# Altium project PythonCamera.PrjPcb
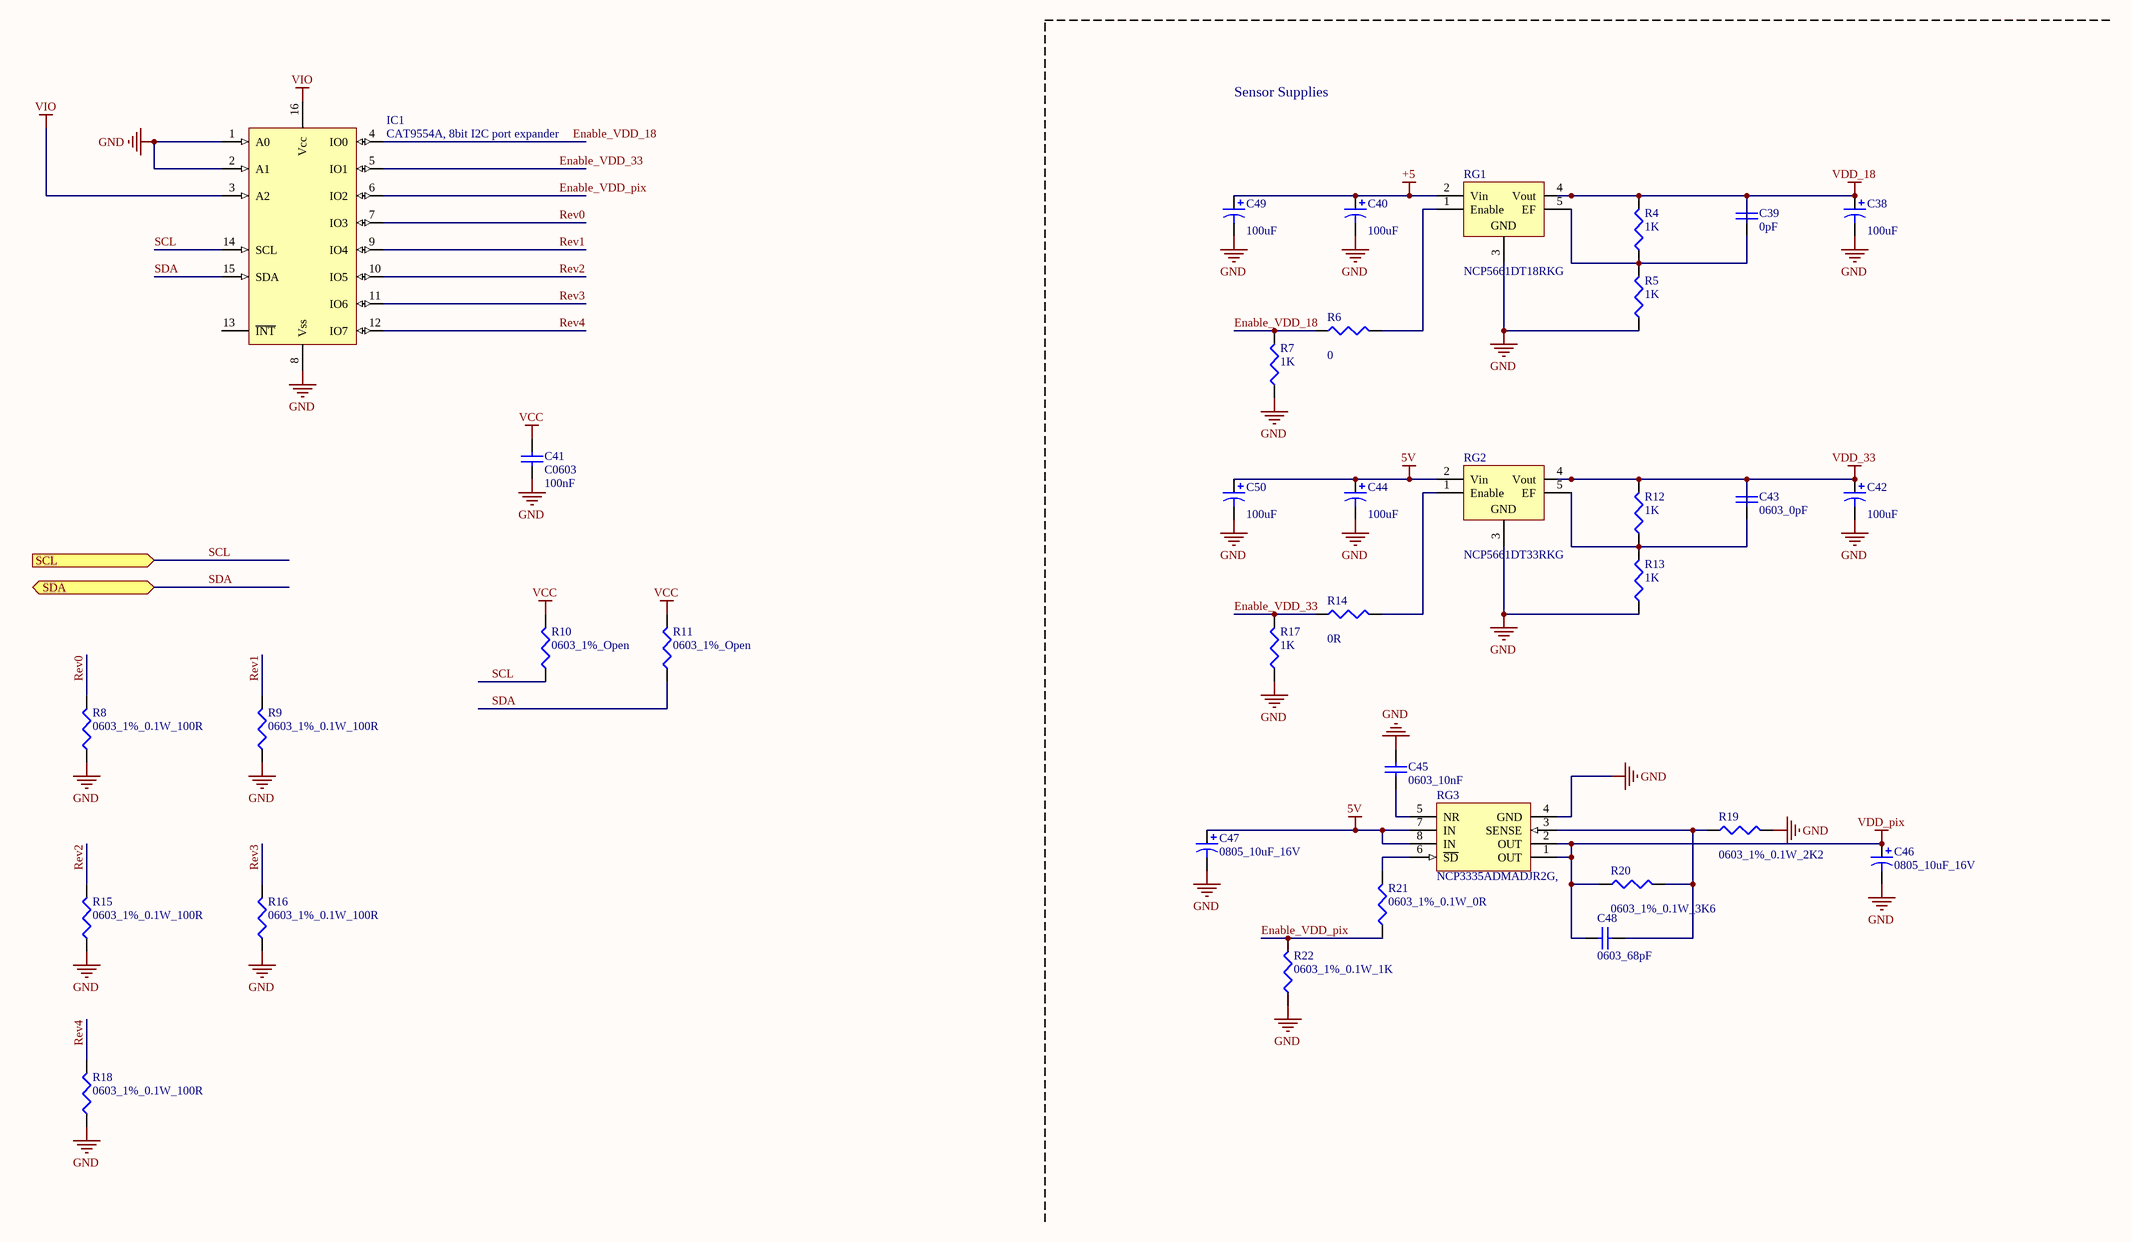
[diagram p0: powerSupply.SchDoc]
2 sheets, 48 parts. Net scope: flat (ports and power ports of the same name join across sheets).
Board file: PythonCamera.PcbDoc
Sheets:
  powerSupply.SchDoc
  imagesensor.SchDoc

## Sheet powerSupply.SchDoc
size C

### Parts
C38  value 100uF  [CC3225-1210]  (hidden comment: T494B)
C39  value 0pF  [0603]  (hidden comment: C0603)
C40  value 100uF  [CC3225-1210]  (hidden comment: T494B)
C41  C0603  value 100nF  [0603]
C42  value 100uF  [CC3225-1210]  (hidden comment: T494B)
C43  value 0603_0pF  [0603]  (hidden comment: C0603)
C44  value 100uF  [CC3225-1210]  (hidden comment: T494B)
C45  value 0603_10nF  [0603]  (hidden comment: C0603)
C46  value 0805_10uF_16V  [C0805]  (hidden comment: Cap Pol3)
C47  value 0805_10uF_16V  [C0805]  (hidden comment: Cap Pol3)
C48  value 0603_68pF  [0603]  (hidden comment: C0603)
C49  value 100uF  [CC3225-1210]  (hidden comment: T494B)
C50  value 100uF  [CC3225-1210]  (hidden comment: T494B)
IC1  CAT9554A, 8bit I2C port expander  [TSSOP16_N]
R4  value 1K  [J1-0603]  (hidden comment: Res3)
R5  value 1K  [J1-0603]  (hidden comment: Res3)
R6  value 0  [J1-0603]  (hidden comment: Res3)
R7  value 1K  [J1-0603]  (hidden comment: Res3)
R8  value 0603_1%_0.1W_100R  [J1-0603]  (hidden comment: Res3)
R9  value 0603_1%_0.1W_100R  [J1-0603]  (hidden comment: Res3)
R10  value 0603_1%_Open  [J1-0603]  (hidden comment: Res3)
R11  value 0603_1%_Open  [J1-0603]  (hidden comment: Res3)
R12  value 1K  [J1-0603]  (hidden comment: Res3)
R13  value 1K  [J1-0603]  (hidden comment: Res3)
R14  value 0R  [J1-0603]  (hidden comment: Res3)
R15  value 0603_1%_0.1W_100R  [J1-0603]  (hidden comment: Res3)
R16  value 0603_1%_0.1W_100R  [J1-0603]  (hidden comment: Res3)
R17  value 1K  [J1-0603]  (hidden comment: Res3)
R18  value 0603_1%_0.1W_100R  [J1-0603]  (hidden comment: Res3)
R19  value 0603_1%_0.1W_2K2  [J1-0603]  (hidden comment: Res3)
R20  value 0603_1%_0.1W_3K6  [J1-0603]  (hidden comment: Res3)
R21  value 0603_1%_0.1W_0R  [J1-0603]  (hidden comment: Res3)
R22  value 0603_1%_0.1W_1K  [J1-0603]  (hidden comment: Res3)
RG1  NCP5661DT18RKG  [D-PAK SIP-G5/Z10.9]
RG2  NCP5661DT33RKG  [D-PAK SIP-G5/Z10.9]
RG3  NCP3335ADMADJR2G,  [ONSC-MICRO-8-846A-02_H_V]

### Ports
SCL (in), SDA (bidir)

### Nets
5V: C44.1 C47.1 C50.1 RG2.2(Vin) RG3.7(IN) RG3.8(IN)
+5: C40.1 C49.1 RG1.2(Vin)
GND: C38.2 C40.2 C41.1 C42.2 C44.2 C45.2 C46.2 C47.2 C49.2 C50.2 IC1.1(A0) IC1.2(A1) IC1.8(Vss) R5.1 R7.1 R8.1 R9.1 R13.1 R15.1 R16.1 R17.1 R18.1 R19.2 R22.1 RG1.3(GND) RG2.3(GND) RG3.4(GND)
VCC: C41.2 R10.2 R11.2
VDD_18: C38.1 C39.2 R4.2 RG1.4(Vout)
VDD_33: C42.1 C43.2 R12.2 RG2.4(Vout)
VDD_pix: C46.1 C48.1 R20.1 RG3.1(OUT) RG3.2(OUT)
VIO: IC1.3(A2) IC1.16(Vcc)
Enable_VDD_18: IC1.4(IO0) R6.1 R7.2
Enable_VDD_33: IC1.5(IO1) R14.1 R17.2
Enable_VDD_pix: IC1.6(IO2) R21.1 R22.2
Rev0: IC1.7(IO3) R8.2
Rev1: IC1.9(IO4) R9.2
Rev2: IC1.10(IO5) R15.2
Rev3: IC1.11(IO6) R16.2
Rev4: IC1.12(IO7) R18.2
SCL: IC1.14(SCL) R10.1 ; port SCL
SDA: IC1.15(SDA) R11.1 ; port SDA
NetC39_1: C39.1 R4.1 R5.2 RG1.5(EF)
NetC43_1: C43.1 R12.1 R13.2 RG2.5(EF)
NetC45_1: C45.1 RG3.5(NR)
NetC48_2: C48.2 R19.1 R20.2 RG3.3(SENSE)
NetR6_2: R6.2 RG1.1(Enable)
NetR14_2: R14.2 RG2.1(Enable)
NetR21_2: R21.2 RG3.6(~{SD})

Not connected (* = marked no-connect by the designer): IC1 13(~{INT})

### Notes on the sheet
- Sensor Supplies

### Library data of the parts
C38 C40 C42 C44 C49 C50 = T494B: Solid Tantalum Chip Capacitor, Standard T494 Series - Low ESR, Industrial Grade; Published: 17-Jul-2002; LatestRevisionDate: 19-Mar-2004; LatestRevisionNote: Silkscreen dimensions re-sized.; DatasheetDocument: Mar-2001; PackageDocument: Mar-2001; PackageReference: B; Publisher: Altium Limited; Code_JEITA: 3528-21; ComponentLink1Description: Manufacturer Link; ComponentLink1URL: http://www.kemet.com/; ComponentLink2Description: Datasheet; ComponentLink2URL: http://www.kemet.com/kemet/web/homepage/kechome.nsf/vapubfilesname/F3102TA.pdf/$file/F3102TA.pdf
C39 C41 C43 C45 C48 = C0603: Ceramic Chip Capacitor - Standard; Note: Footprint corresponds to dimensions for bulk cassette packaging. This case size has tightened tolerances.; Published: 17-Jul-2002; LatestRevisionDate: 19-Mar-2004; LatestRevisionNote: Silkscreen size reduced.; DatasheetDocument: Mar-2001; PackageDocument: Mar-2001; PackageReference: 0603; Publisher: Altium Limited; Code_JEITA: 0603; Code_IPC: 1608 [0603]; ComponentLink1Description: Manufacturer Link; ComponentLink1URL: http://www.kemet.com/; ComponentLink2Description: Datasheet; ComponentLink2URL: http://www.kemet.com/kemet/web/homepage/kechome.nsf/vapubfilesname/F3102TA.pdf/$file/F3102TA.pdf
C46 C47 = Cap Pol3: Polarized Capacitor (Surface Mount); Published: 8-Jun-2000; LatestRevisionDate: 29-May-2009; LatestRevisionNote: IPC-7351 Footprint Added.; PackageReference: C0805; Publisher: Altium Limited; PackageDescription: Chip Capacitor
IC1 = CAT9554A: 8bit I2C port expander; Published: 16-Jan-2001; LatestRevisionDate: 13-Apr-2006; LatestRevisionNote: IPC-7351 Footprint Added.; DatasheetVersion: 1996; PackageReference: WSO16; Publisher: Altium Limited; PackageDescription: 16-Pin Small Outline Integrated Circuit 1.27 mm Pitch; Code_JEDEC: MS-013-AA; Code_IPC: SOIC127P1030-16; ComponentLink1Description: Manufacturer Link; ComponentLink1URL: http://www.maxim-ic.com/; ComponentLink2Description: Datasheet; ComponentLink2URL: http://pdfserv.maxim-ic.com/en/ds/DG300A-DG303A.pdf
R4-R22 = Res3: Resistor; Published: 8-Jun-2000; LatestRevisionDate: 29-May-2009; LatestRevisionNote: IPC-7351 Footprint Added.; PackageReference: J1-0603; Publisher: Altium Limited; PackageDescription: Chip Resistor
RG1 RG2 = NCP5661: Low Dropout Voltage Regulator; Note: Heatsink surface is connected to Pin 3; Published: 15-Apr-2002; DatasheetVersion: 1997; PackageVersion: 1997; PackageReference: 314A-03; Publisher: Altium Limited; PackageDescription: TO, Thru-Hole, Horizontal, Heatsink Mounted; 5 Bent Staggered Leads; Pitch 1.7 mm; ComponentLink1Description: Manufacturer Link; ComponentLink1URL: http://www.onsemi.com/site/products/taxonomy/0,4438,503,00.html; ComponentLink2Description: Datasheet; ComponentLink2URL: http://www.onsemi.com/pub/Collateral/LM2931-D.PDF
RG3 = NCP3335: NCP3335ADMADJR2G, ADJ Ultra High Accuracy, Low Iq, 500 mA Low Dropout Regulator; Published: 15-Apr-2002; LatestRevisionDate: 13-Apr-2006; LatestRevisionNote: IPC-7351 Footprint Added.; DatasheetVersion: 1998; PackageVersion: 1998; PackageReference: 751-05; Publisher: Altium Limited; PackageDescription: 8-Pin Small Outline Integrated Circuit 1.27 mm Pitch; Code_JEDEC: MS-012-AA; Code_IPC: SOIC127P600-8; ComponentLink1Description: Manufacturer Link; ComponentLink1URL: http://www.onsemi.com/site/products/taxonomy/0,4438,503,00.html; ComponentLink2Description: Datasheet; ComponentLink2URL: http://www.onsemi.com/pub/Collateral/MC33264-D.PDF

## Sheet imagesensor.SchDoc
size A3
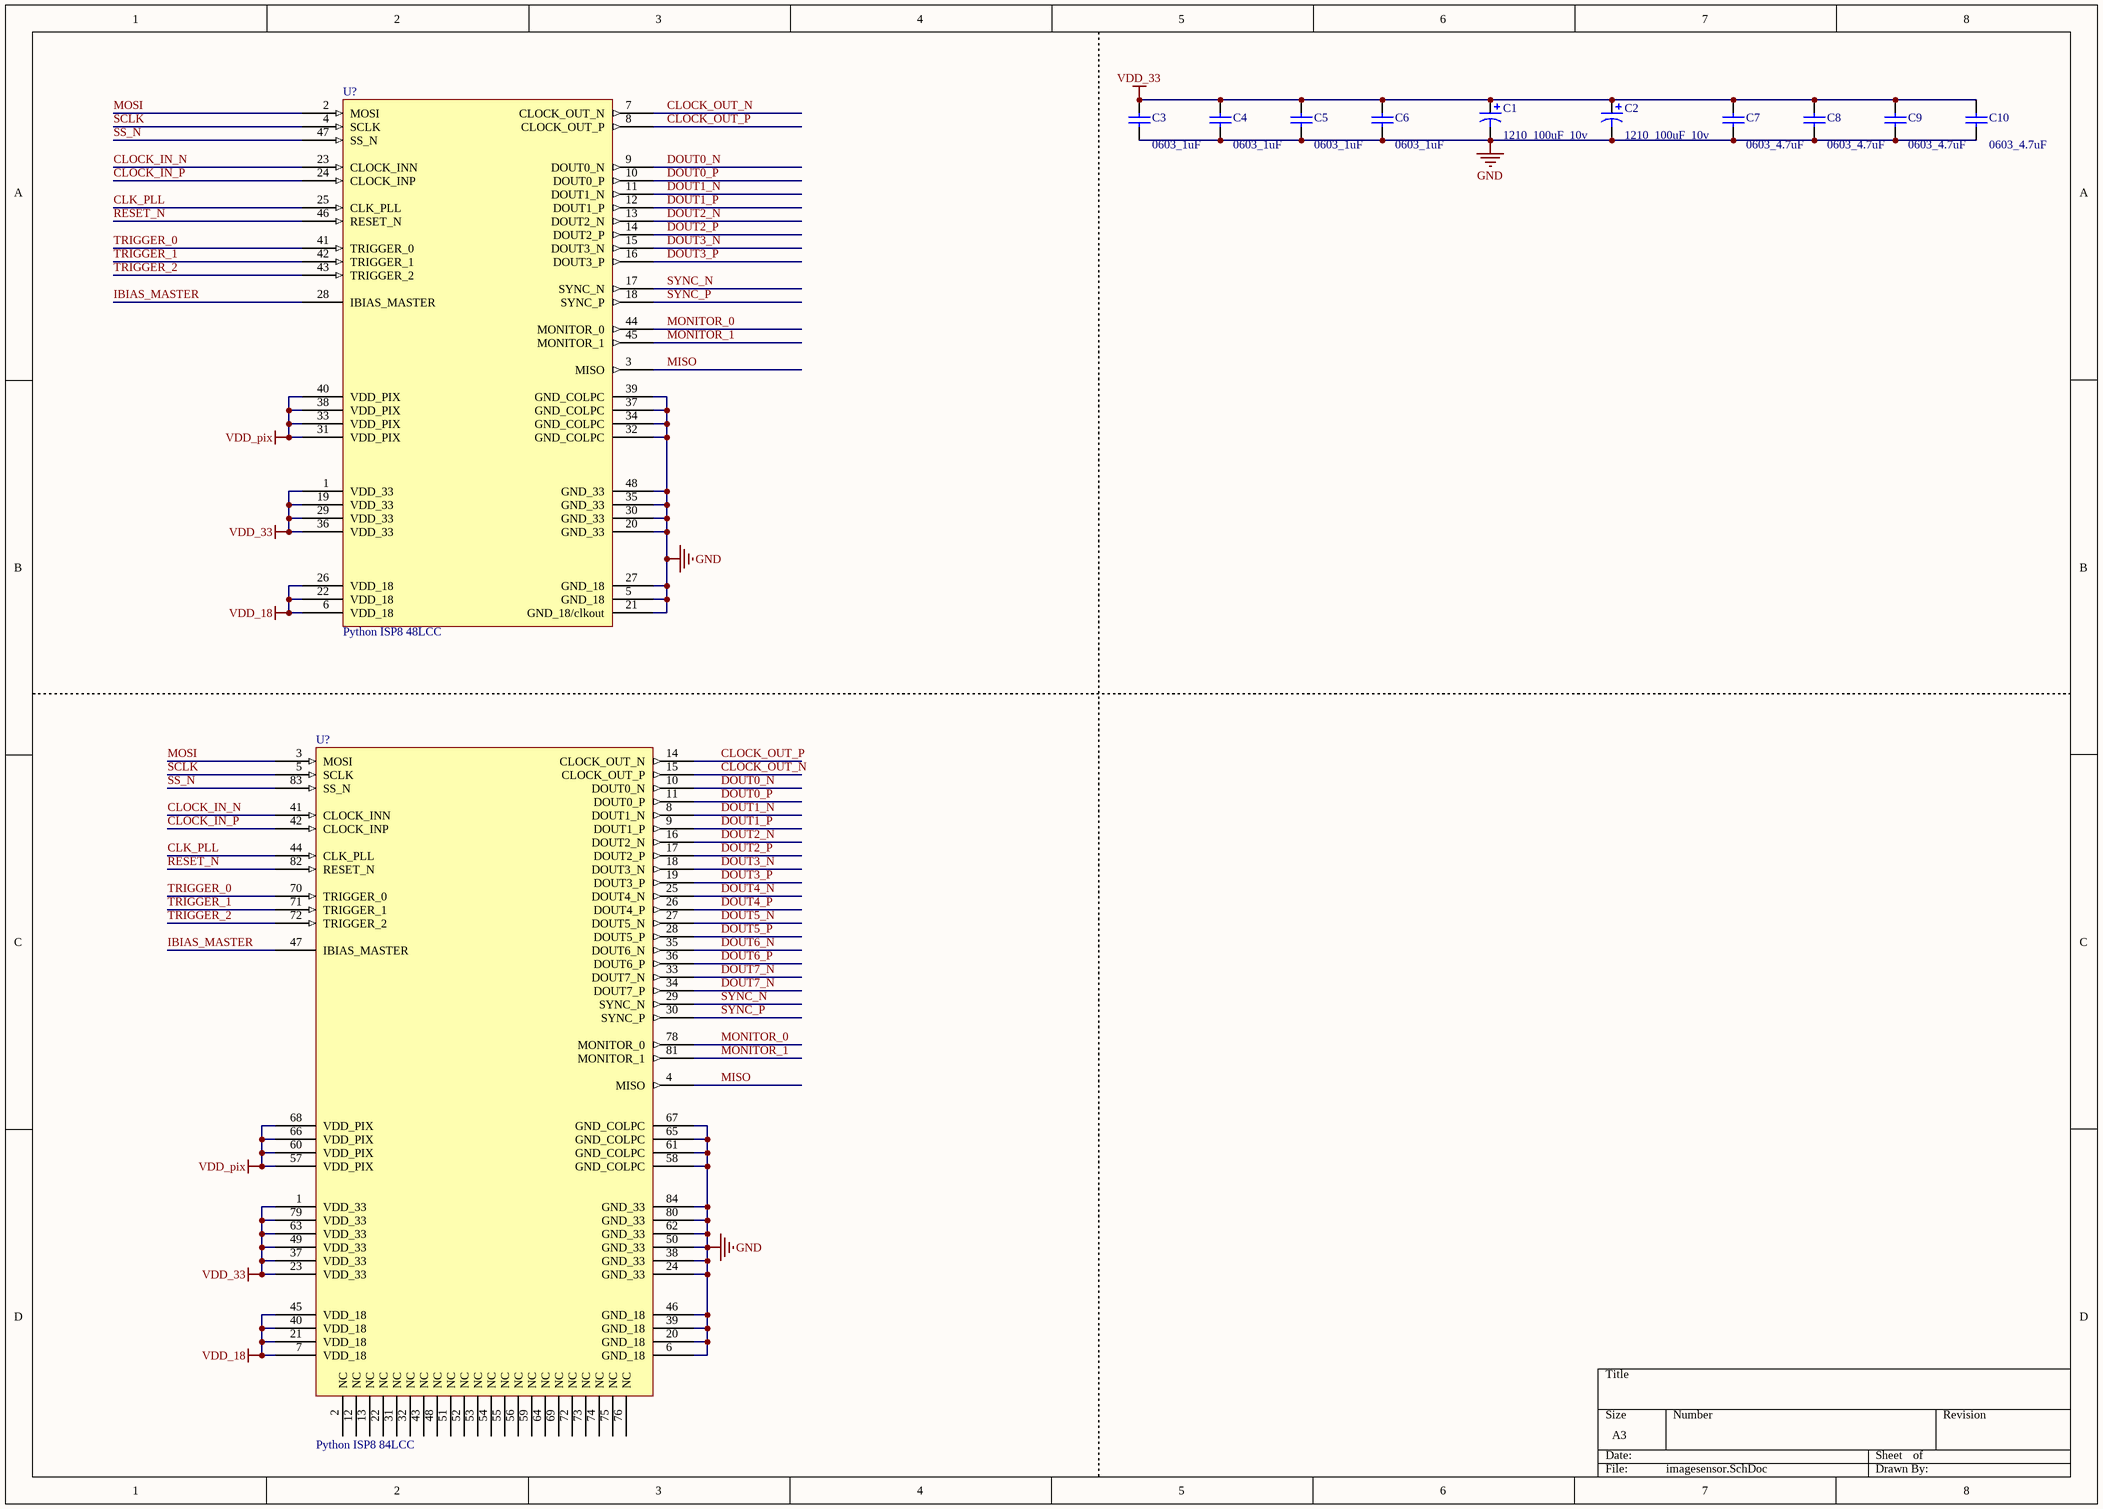
[diagram p1: imagesensor.SchDoc]

### Parts
(Parts that share a designator on the sheet are numbered #1, #2 ... from top to bottom, then left to right.)
C1  value 1210_100uF_10v  [CC3225-1210]  (hidden comment: T494B)
C2  value 1210_100uF_10v  [CC3225-1210]  (hidden comment: T494B)
C3  value 0603_1uF  [0603]  (hidden comment: C0603)
C4  value 0603_1uF  [0603]  (hidden comment: C0603)
C5  value 0603_1uF  [0603]  (hidden comment: C0603)
C6  value 0603_1uF  [0603]  (hidden comment: C0603)
C7  value 0603_4.7uF  [0603]  (hidden comment: C0603)
C8  value 0603_4.7uF  [0603]  (hidden comment: C0603)
C9  value 0603_4.7uF  [0603]  (hidden comment: C0603)
C10  value 0603_4.7uF  [0603]  (hidden comment: C0603)
U?#1  Python ISP8 48LCC  [LCC48]
U?#2  Python ISP8 84LCC  [PLCC84_L]

### Nets
GND: C1.2 C2.2 C3.1 C4.1 C5.1 C6.1 C7.1 C8.1 C9.1 C10.1 U?#1.5(GND_18) U?#1.20(GND_33) U?#1.21(GND_18/clkout) U?#1.27(GND_18) U?#1.30(GND_33) U?#1.32(GND_COLPC) U?#1.34(GND_COLPC) U?#1.35(GND_33) U?#1.37(GND_COLPC) U?#1.39(GND_COLPC) U?#1.48(GND_33) U?#2.6(GND_18) U?#2.20(GND_18) U?#2.24(GND_33) U?#2.38(GND_33) U?#2.39(GND_18) U?#2.46(GND_18) U?#2.50(GND_33) U?#2.58(GND_COLPC) U?#2.61(GND_COLPC) U?#2.62(GND_33) U?#2.65(GND_COLPC) U?#2.67(GND_COLPC) U?#2.80(GND_33) U?#2.84(GND_33)
VDD_18: U?#1.6(VDD_18) U?#1.22(VDD_18) U?#1.26(VDD_18) U?#2.7(VDD_18) U?#2.21(VDD_18) U?#2.40(VDD_18) U?#2.45(VDD_18)
VDD_33: C1.1 C2.1 C3.2 C4.2 C5.2 C6.2 C7.2 C8.2 C9.2 C10.2 U?#1.1(VDD_33) U?#1.19(VDD_33) U?#1.29(VDD_33) U?#1.36(VDD_33) U?#2.1(VDD_33) U?#2.23(VDD_33) U?#2.37(VDD_33) U?#2.49(VDD_33) U?#2.63(VDD_33) U?#2.79(VDD_33)
VDD_pix: U?#1.31(VDD_PIX) U?#1.33(VDD_PIX) U?#1.38(VDD_PIX) U?#1.40(VDD_PIX) U?#2.57(VDD_PIX) U?#2.60(VDD_PIX) U?#2.66(VDD_PIX) U?#2.68(VDD_PIX)
CLK_PLL: U?#1.25(CLK_PLL) U?#2.44(CLK_PLL)
CLOCK_IN_N: U?#1.23(CLOCK_INN) U?#2.41(CLOCK_INN)
CLOCK_IN_P: U?#1.24(CLOCK_INP) U?#2.42(CLOCK_INP)
CLOCK_OUT_N: U?#1.7(CLOCK_OUT_N) U?#2.15(CLOCK_OUT_P)
CLOCK_OUT_P: U?#1.8(CLOCK_OUT_P) U?#2.14(CLOCK_OUT_N)
DOUT0_N: U?#1.9(DOUT0_N) U?#2.10(DOUT0_N)
DOUT0_P: U?#1.10(DOUT0_P) U?#2.11(DOUT0_P)
DOUT1_N: U?#1.11(DOUT1_N) U?#2.8(DOUT1_N)
DOUT1_P: U?#1.12(DOUT1_P) U?#2.9(DOUT1_P)
DOUT2_N: U?#1.13(DOUT2_N) U?#2.16(DOUT2_N)
DOUT2_P: U?#1.14(DOUT2_P) U?#2.17(DOUT2_P)
DOUT3_N: U?#1.15(DOUT3_N) U?#2.18(DOUT3_N)
DOUT3_P: U?#1.16(DOUT3_P) U?#2.19(DOUT3_P)
DOUT4_N: U?#2.25(DOUT4_N)
DOUT4_P: U?#2.26(DOUT4_P)
DOUT5_N: U?#2.27(DOUT5_N)
DOUT5_P: U?#2.28(DOUT5_P)
DOUT6_N: U?#2.35(DOUT6_N)
DOUT6_P: U?#2.36(DOUT6_P)
DOUT7_N: U?#2.33(DOUT7_N) U?#2.34(DOUT7_P)
IBIAS_MASTER: U?#1.28(IBIAS_MASTER) U?#2.47(IBIAS_MASTER)
MISO: U?#1.3(MISO) U?#2.4(MISO)
MONITOR_0: U?#1.44(MONITOR_0) U?#2.78(MONITOR_0)
MONITOR_1: U?#1.45(MONITOR_1) U?#2.81(MONITOR_1)
MOSI: U?#1.2(MOSI) U?#2.3(MOSI)
RESET_N: U?#1.46(RESET_N) U?#2.82(RESET_N)
SCLK: U?#1.4(SCLK) U?#2.5(SCLK)
SS_N: U?#1.47(SS_N) U?#2.83(SS_N)
SYNC_N: U?#1.17(SYNC_N) U?#2.29(SYNC_N)
SYNC_P: U?#1.18(SYNC_P) U?#2.30(SYNC_P)
TRIGGER_0: U?#1.41(TRIGGER_0) U?#2.70(TRIGGER_0)
TRIGGER_1: U?#1.42(TRIGGER_1) U?#2.71(TRIGGER_1)
TRIGGER_2: U?#1.43(TRIGGER_2) U?#2.72(TRIGGER_2)

Not connected (* = marked no-connect by the designer): U?#2 2(NC) 12(NC) 13(NC) 22(NC) 31(NC) 32(NC) 43(NC) 48(NC) 51(NC) 52(NC) 53(NC) 54(NC) 55(NC) 56(NC) 59(NC) 64(NC) 69(NC) 73(NC) 74(NC) 75(NC) 76(NC)

### Library data of the parts
C1 C2 = T494B: as C38 on sheet powerSupply; Published: 17-Jul-2002; LatestRevisionDate: 19-Mar-2004; LatestRevisionNote: Silkscreen dimensions re-sized.; DatasheetDocument: Mar-2001; PackageDocument: Mar-2001; PackageReference: B; Publisher: Altium Limited; Code_JEITA: 3528-21; ComponentLink1Description: Manufacturer Link; ComponentLink1URL: http://www.kemet.com/; ComponentLink2Description: Datasheet; ComponentLink2URL: http://www.kemet.com/kemet/web/homepage/kechome.nsf/vapubfilesname/F3102TA.pdf/$file/F3102TA.pdf
C3-C10 = C0603: as C39 on sheet powerSupply; Published: 17-Jul-2002; LatestRevisionDate: 19-Mar-2004; LatestRevisionNote: Silkscreen size reduced.; DatasheetDocument: Mar-2001; PackageDocument: Mar-2001; PackageReference: 0603; Publisher: Altium Limited; Code_JEITA: 0603; Code_IPC: 1608 [0603]; ComponentLink1Description: Manufacturer Link; ComponentLink1URL: http://www.kemet.com/; ComponentLink2Description: Datasheet; ComponentLink2URL: http://www.kemet.com/kemet/web/homepage/kechome.nsf/vapubfilesname/F3102TA.pdf/$file/F3102TA.pdf
U?#1 = Python ISP8 48LCC: Python ISP8 28LCC; Published: 23-Sep-2002; LatestRevisionDate: 13-Apr-2006; LatestRevisionNote: IPC-7351 Footprint Added.; DatasheetVersion: Jul-1999; PackageVersion: ver14.3, Jul-2006; PackageReference: RQFP208; Publisher: Altium Limited; PackageDescription: 208-Pin Power Quad Flat Pack (RQFP208); Code_JEDEC: MS-029-FA-1; ComponentLink1Description: Manufacturer Link; ComponentLink1URL: http://www.altera.com/products/devices/max9k/m9k-index.html; ComponentLink2Description: Datasheet; ComponentLink2URL: http://www.altera.com/literature/ds/m9000.pdf
U?#2 = Python ISP8 84LCC: MAX 9000 PLD with 191 I/O Pins, 240-Pin RQFP, Industrial Grade; Published: 23-Sep-2002; LatestRevisionDate: 13-Apr-2006; LatestRevisionNote: IPC-7351 Footprint Added.; DatasheetVersion: Jul-1999; PackageVersion: ver14.2, Oct-2005; PackageReference: RQFP240; Publisher: Altium Limited; PackageDescription: 240-Pin Power Quad Flat Pack (RQFP240); Supplier 1: Digi-Key; Supplier Part Number 1: 544-2365-ND; Code_JEDEC: MS-029-GA; ComponentLink1Description: Manufacturer Link; ComponentLink1URL: http://www.altera.com/products/devices/max9k/m9k-index.html; ComponentLink2Description: Datasheet; ComponentLink2URL: http://www.altera.com/literature/ds/m9000.pdf

## Nets that join several sheets
GND: powerSupply (27 pins), imagesensor (35 pins)
VDD_18: powerSupply (C38.1 C39.2 R4.2 RG1.4), imagesensor (7 pins)
VDD_33: powerSupply (C42.1 C43.2 R12.2 RG2.4), imagesensor (20 pins)
VDD_pix: powerSupply (5 pins), imagesensor (8 pins)